# EAGLE schematic RTxController (EAGLE 6.5.0)

## Sheet 1 of 4: Analog
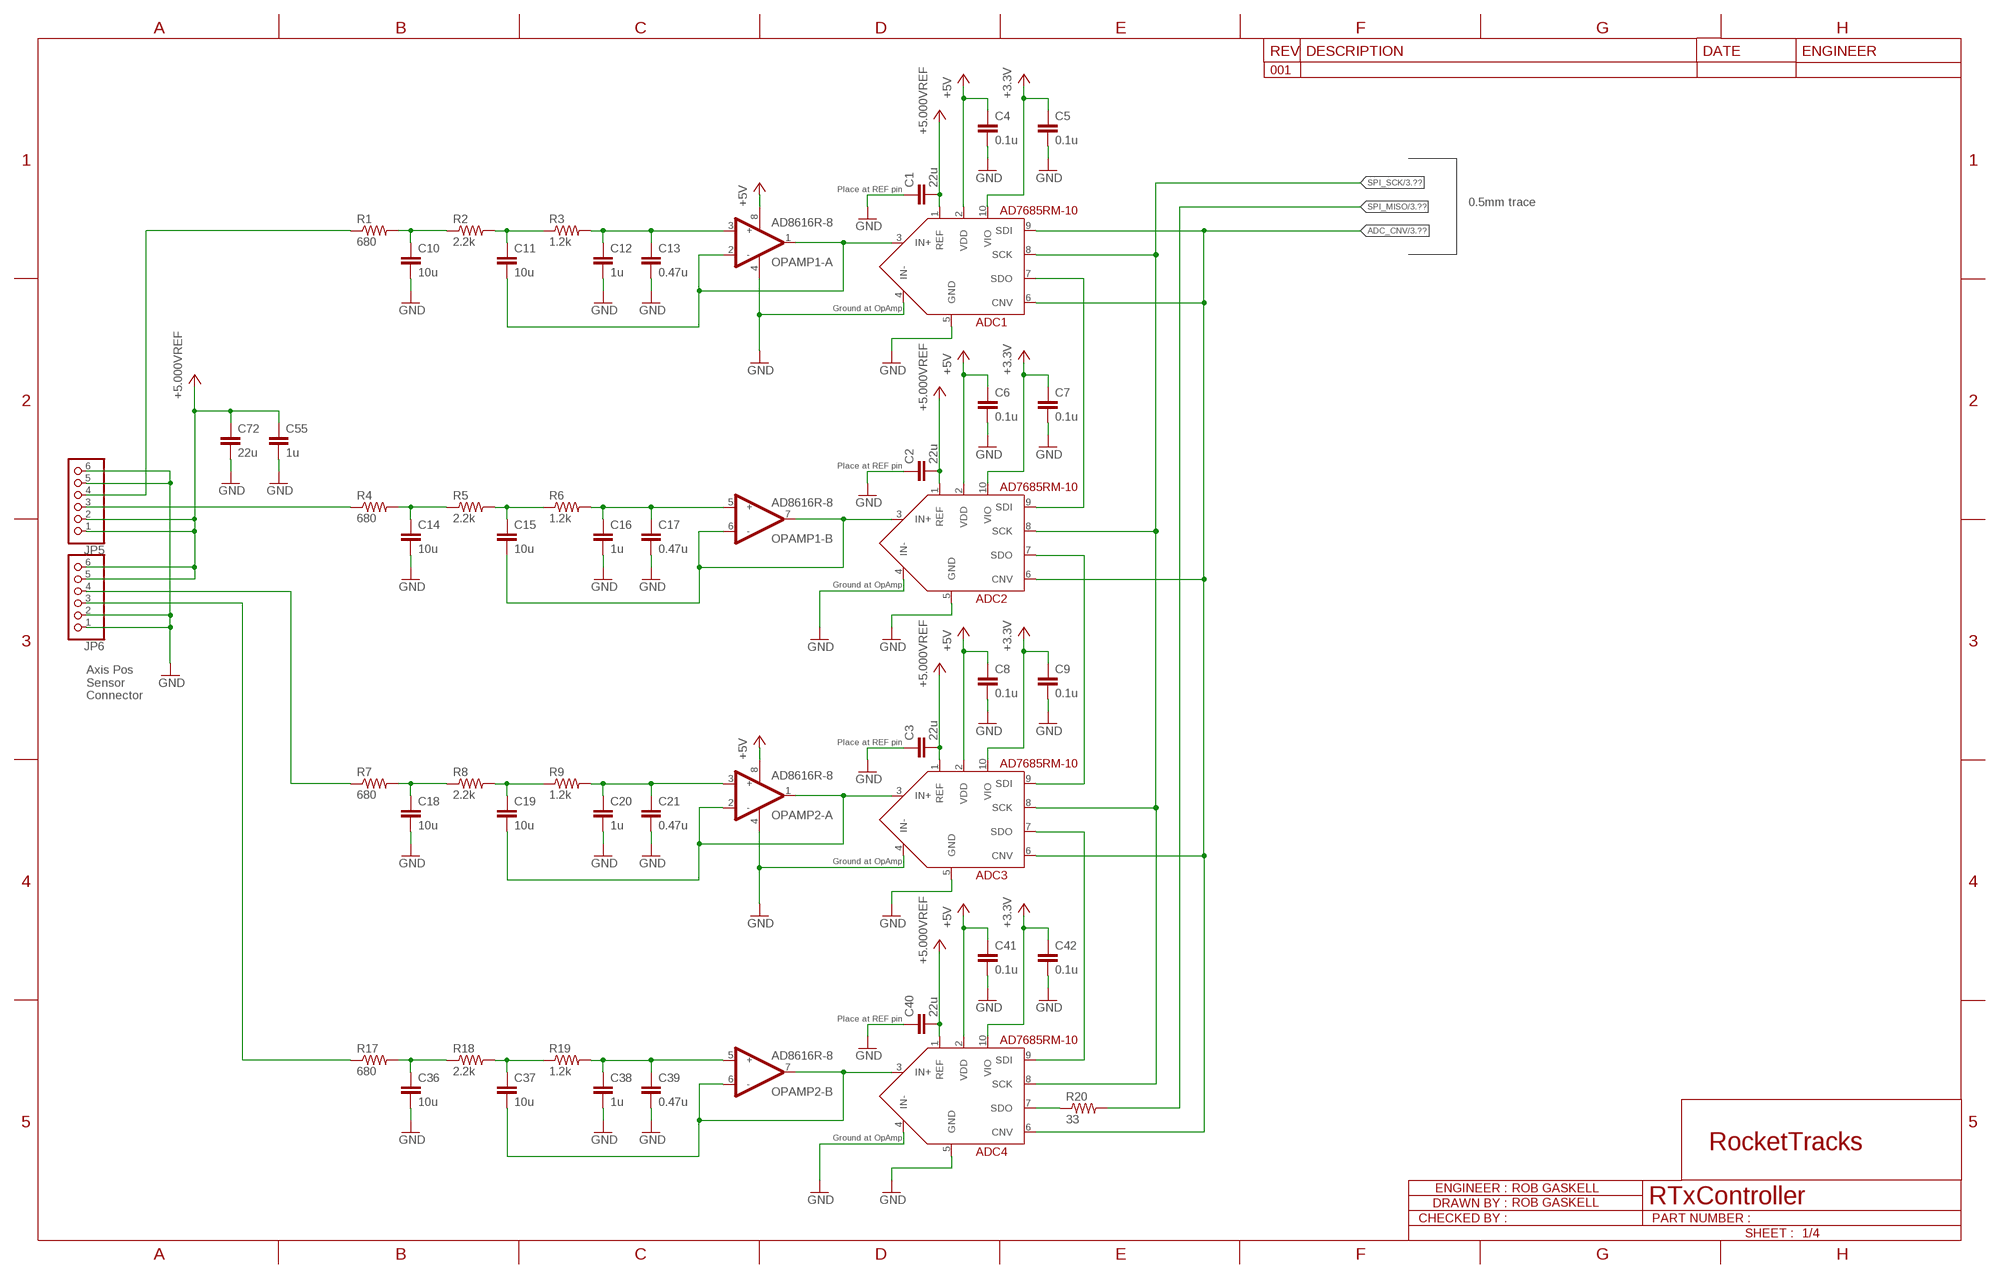
[diagram p0: schematic, sheet 1]

### Parts
ADC1  AD7685RM-10  [MSOP-10]
ADC2  AD7685RM-10  [MSOP-10]
ADC3  AD7685RM-10  [MSOP-10]
ADC4  AD7685RM-10  [MSOP-10]
C1  22u  C-EUC1206  [C1206]
C2  22u  C-EUC1206  [C1206]
C3  22u  C-EUC1206  [C1206]
C4  0.1u  C-EUC0402  [C0402]
C5  0.1u  C-EUC0402  [C0402]
C6  0.1u  C-EUC0402  [C0402]
C7  0.1u  C-EUC0402  [C0402]
C8  0.1u  C-EUC0402  [C0402]
C9  0.1u  C-EUC0402  [C0402]
C10  10u  C-EUC1206  [C1206]
C11  10u  C-EUC1206  [C1206]
C12  1u  C-EUC0805  [C0805]
C13  0.47u  C-EUC0805  [C0805]
C14  10u  C-EUC1206  [C1206]
C15  10u  C-EUC1206  [C1206]
C16  1u  C-EUC0805  [C0805]
C17  0.47u  C-EUC0805  [C0805]
C18  10u  C-EUC1206  [C1206]
C19  10u  C-EUC1206  [C1206]
C20  1u  C-EUC0805  [C0805]
C21  0.47u  C-EUC0805  [C0805]
C36  10u  C-EUC1206  [C1206]
C37  10u  C-EUC1206  [C1206]
C38  1u  C-EUC0805  [C0805]
C39  0.47u  C-EUC0805  [C0805]
C40  22u  C-EUC1206  [C1206]
C41  0.1u  C-EUC0402  [C0402]
C42  0.1u  C-EUC0402  [C0402]
C55  1u  C-EUC0805  [C0805]
C72  22u  C-EUC1206  [C1206]
JP5  PINHD-1X6  [1X06]
JP6  PINHD-1X6  [1X06]
OPAMP1  AD8616R-8  [SOIC8]
OPAMP2  AD8616R-8  [SOIC8]
R1  680  R-US_R0402  [R0402]
R2  2.2k  R-US_R0402  [R0402]
R3  1.2k  R-US_R0402  [R0402]
R4  680  R-US_R0402  [R0402]
R5  2.2k  R-US_R0402  [R0402]
R6  1.2k  R-US_R0402  [R0402]
R7  680  R-US_R0402  [R0402]
R8  2.2k  R-US_R0402  [R0402]
R9  1.2k  R-US_R0402  [R0402]
R17  680  R-US_R0402  [R0402]
R18  2.2k  R-US_R0402  [R0402]
R19  1.2k  R-US_R0402  [R0402]
R20  33  R-US_R0402  [R0402]

### Nets
+3.3V [PWR]: ADC1.10(VIO) ADC2.10(VIO) ADC3.10(VIO) ADC4.10(VIO) C5.1 C7.1 C9.1 C42.1 ; also sheet 2,3,4
+5.000VREF [PWR]: ADC1.1(REF) ADC2.1(REF) ADC3.1(REF) ADC4.1(REF) C1.2 C2.2 C3.2 C40.2 C55.1 C72.1 JP5.1 JP5.2 JP6.5 JP6.6 ; also sheet 2
+5V: ADC1.2(VDD) ADC2.2(VDD) ADC3.2(VDD) ADC4.2(VDD) C4.1 C6.1 C8.1 C41.1 OPAMP1.8(-A:V+) OPAMP2.8(-A:V+) ; also sheet 2
ADC1_IN+: ADC1.3(IN+) C11.2 OPAMP1.1(-A:OUT_A) OPAMP1.2(-A:-)
ADC2_IN+: ADC2.3(IN+) C15.2 OPAMP1.6(-B:-) OPAMP1.7(-B:OUT_B)
ADC3_IN+: ADC3.3(IN+) C19.2 OPAMP2.1(-A:OUT_A) OPAMP2.2(-A:-)
ADC4_IN: ADC4.3(IN+) C37.2 OPAMP2.6(-B:-) OPAMP2.7(-B:OUT_B)
ADC_CNV: ADC1.6(CNV) ADC1.9(SDI) ADC2.6(CNV) ADC3.6(CNV) ADC4.6(CNV) ; also sheet 3
AXIS3_IN: JP6.4 R7.1
AXIS4_IN: JP6.3 R17.1
GND: ADC1.4(IN-) ADC1.5(GND) ADC2.4(IN-) ADC2.5(GND) ADC3.4(IN-) ADC3.5(GND) ADC4.4(IN-) ADC4.5(GND) C1.1 C2.1 C3.1 C4.2 C5.2 C6.2 C7.2 C8.2 C9.2 C10.2 C12.2 C13.2 C14.2 C16.2 C17.2 C18.2 C20.2 C21.2 C36.2 C38.2 C39.2 C40.1 C41.2 C42.2 C55.2 C72.2 JP5.5 JP5.6 JP6.1 JP6.2 OPAMP1.4(-A:V-) OPAMP2.4(-A:V-) ; also sheet 2,3,4
LAT_AXIS_IN: JP5.4 R1.1
N$1: C12.1 C13.1 OPAMP1.3(-A:+) R3.2
N$2: C16.1 C17.1 OPAMP1.5(-B:+) R6.2
N$3: C38.1 C39.1 OPAMP2.5(-B:+) R19.2
N$4: C11.1 R2.2 R3.1
N$5: C37.1 R18.2 R19.1
N$8: C15.1 R5.2 R6.1
N$10: C36.1 R17.2 R18.1
N$11: C14.1 R4.2 R5.1
N$12: C20.1 C21.1 OPAMP2.3(-A:+) R9.2
N$13: C19.1 R8.2 R9.1
N$16: C18.1 R7.2 R8.1
N$22: C10.1 R1.2 R2.1
SDO1: ADC1.7(SDO) ADC2.9(SDI)
SDO2: ADC2.7(SDO) ADC3.9(SDI)
SDO3: ADC3.7(SDO) ADC4.9(SDI)
SDO4: ADC4.7(SDO) R20.1
SPI_MISO: R20.2 ; also sheet 3
SPI_SCK: ADC1.8(SCK) ADC2.8(SCK) ADC3.8(SCK) ADC4.8(SCK) ; also sheet 3
VERT_AXIS_IN: JP5.3 R4.1

### Notes on the sheet
- Place at REF pin
- 0.5mm trace
- Ground at OpAmp
- Place at REF pin
- Ground at OpAmp
- Axis Pos
  Sensor
  Connector
- Place at REF pin
- Ground at OpAmp
- Place at REF pin
- Ground at OpAmp

## Sheet 2 of 4: Power
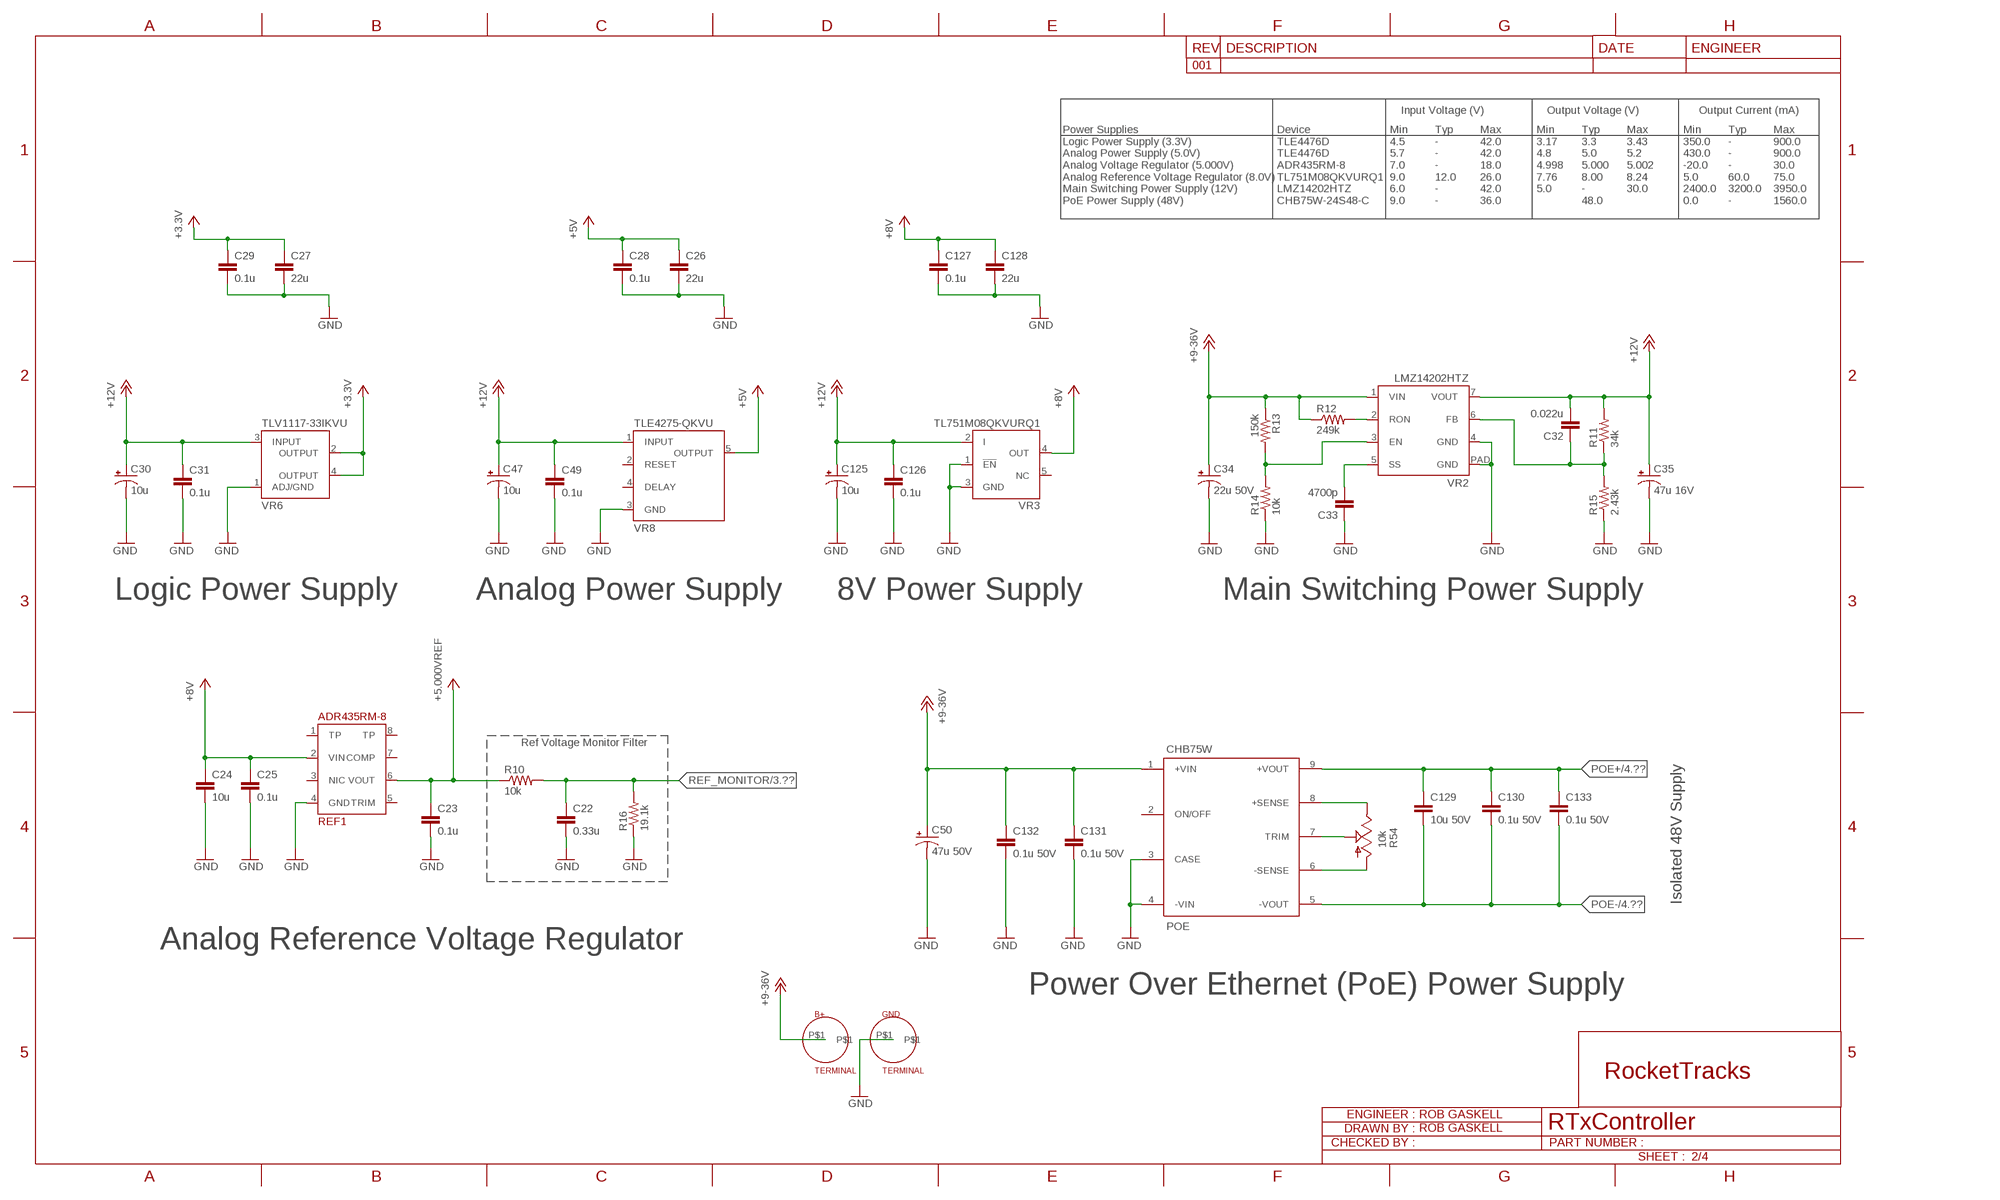
[diagram p1: schematic, sheet 2]

### Parts
B+  TERMINAL  [TERMINAL_RELAY]
C22  0.33u  C-EUC0603  [C0603]
C23  0.1u  C-EUC0402  [C0402]
C24  10u  C-EUC1206  [C1206]
C25  0.1u  C-EUC0402  [C0402]
C26  22u  C-EUC1206  [C1206]
C27  22u  C-EUC1206  [C1206]
C28  0.1u  C-EUC0402  [C0402]
C29  0.1u  C-EUC0402  [C0402]
C30  10u  CPOL-USB  [PANASONIC_B]
C31  0.1u  C-EUC0402  [C0402]
C32  0.022u  C-EUC0402  [C0402]
C33  4700p  C-EUC0402  [C0402]
C34  22u 50V  CPOL-USB  [PANASONIC_B]
C35  47u 16V  CPOL-USB  [PANASONIC_B]
C47  10u  CPOL-USB  [PANASONIC_B]
C49  0.1u  C-EUC0402  [C0402]
C50  47u 50V  CPOL-USC  [PANASONIC_C]
C125  10u  CPOL-USB  [PANASONIC_B]
C126  0.1u  C-EUC0402  [C0402]
C127  0.1u  C-EUC0402  [C0402]
C128  22u  C-EUC1206  [C1206]
C129  10u 50V  C-EUC1206  [C1206]
C130  0.1u 50V  C-EUC0402  [C0402]
C131  0.1u 50V  C-EUC0402  [C0402]
C132  0.1u 50V  C-EUC0402  [C0402]
C133  0.1u 50V  C-EUC0402  [C0402]
GND  TERMINAL  [TERMINAL_RELAY]
POE  CHB75W  [CHB75W]
R10  10k  R-US_R0402  [R0402]
R11  34k  R-US_R0603  [R0603]
R12  249k  R-US_R0603  [R0603]
R13  150k  R-US_R0603  [R0603]
R14  10k  R-US_R0603  [R0603]
R15  2.43k  R-US_R0603  [R0603]
R16  19.1k  R-US_R0402  [R0402]
R54  10k  TRIM_US-3223W  [3223W]
REF1  ADR435RM-8  [SOIC8]
VR2  LMZ14202HTZ  [PFM-7]
VR3  TL751M08QKVURQ1  [PG-TO252-5-11]
VR6  TLV1117-33IKVU  [PG-TO252-3-11]
VR8  TLE4275-QKVU  [PG-TO252-5-11]

### Nets
+3.3V [PWR]: C27.1 C29.1 VR6.2(OUTPUT) VR6.4(OUTPUT) ; also sheet 1,3,4
+5.000VREF [PWR]: C23.1 R10.1 REF1.6(VOUT) ; also sheet 1
+5V: C26.1 C28.1 VR8.5(OUTPUT) ; also sheet 1
+8V [PWR]: C24.1 C25.1 C127.1 C128.1 REF1.2(VIN) VR3.4(OUT)
+9-36V: B+.P$1 C34.+ C50.+ C131.1 C132.1 POE.1(+VIN) R12.1 R13.1 VR2.1(VIN)
+12V: C30.+ C31.1 C32.2 C35.+ C47.+ C49.1 C125.+ C126.1 R11.2 VR2.7(VOUT) VR3.2(I) VR6.3(INPUT) VR8.1(INPUT)
GND: C22.2 C23.2 C24.2 C25.2 C26.2 C27.2 C28.2 C29.2 C30.- C31.2 C33.1 C34.- C35.- C47.- C49.2 C50.- C125.- C126.2 C127.2 C128.2 C131.2 C132.2 GND.P$1 POE.3(CASE) POE.4(-VIN) R14.1 R15.1 R16.1 REF1.4(GND) VR2.4(GND) VR2.PAD(GND) VR3.1(!EN!) VR3.3(GND) VR6.1(ADJ/GND) VR8.3(GND) ; also sheet 1,3,4
N$17: R12.2 VR2.2(RON)
N$18: R13.2 R14.2 VR2.3(EN)
N$19: C33.2 VR2.5(SS)
N$20: C32.1 R11.1 R15.2 VR2.6(FB)
N$65: POE.7(TRIM) R54.2(S)
N$66: POE.6(-SENSE) R54.1(A)
N$67: POE.8(+SENSE) R54.3(E)
POE+: C129.1 C130.1 C133.1 POE.9(+VOUT) ; also sheet 4
POE-: C129.2 C130.2 C133.2 POE.5(-VOUT) ; also sheet 4
REF_MONITOR: C22.1 R10.2 R16.2 ; also sheet 3
Unconnected: POE.2(ON/OFF) REF1.1(TP) REF1.3(NIC) REF1.5(TRIM) REF1.7(COMP) REF1.8(TP) VR3.5(NC) VR8.2(RESET) VR8.4(DELAY)

### Notes on the sheet
- Input Voltage (V)                     Output Voltage (V)                    Output Current (mA)
- Power Supplies
  Logic Power Supply (3.3V)
  Analog Power Supply (5.0V)
  Analog Voltage Regulator (5.000V)
  Analog Reference Voltage Regulator (8.0V)
  Main Switching Power Supply (12V)
  PoE Power Supply (48V)
- Device
  TLE4476D
  TLE4476D
  ADR435RM-8
  TL751M08QKVURQ1
  LMZ14202HTZ
  CHB75W-24S48-C
- Min
  4.5
  5.7
  7.0
  9.0
  6.0
  9.0
- Typ
  -
  -
  -
  12.0
  -
  -
- Max
  42.0
  42.0
  18.0
  26.0
  42.0
  36.0
- Min
  3.17
  4.8
  4.998
  7.76
  5.0
- Typ
  3.3
  5.0
  5.000
  8.00
  -
  48.0
- Max
  3.43
  5.2
  5.002
  8.24
  30.0
- Min
  350.0
  430.0
  -20.0
  5.0
  2400.0
  0.0
- Typ
  -
  -
  -
  60.0
  3200.0
  -
- Max
  900.0
  900.0
  30.0
  75.0
  3950.0
  1560.0
- Logic Power Supply | Analog Power Supply | 8V Power Supply | Main Switching Power Supply
- Ref Voltage Monitor Filter
- Isolated 48V Supply
- Analog Reference Voltage Regulator
- Power Over Ethernet (PoE) Power Supply

## Sheet 3 of 4: MCU
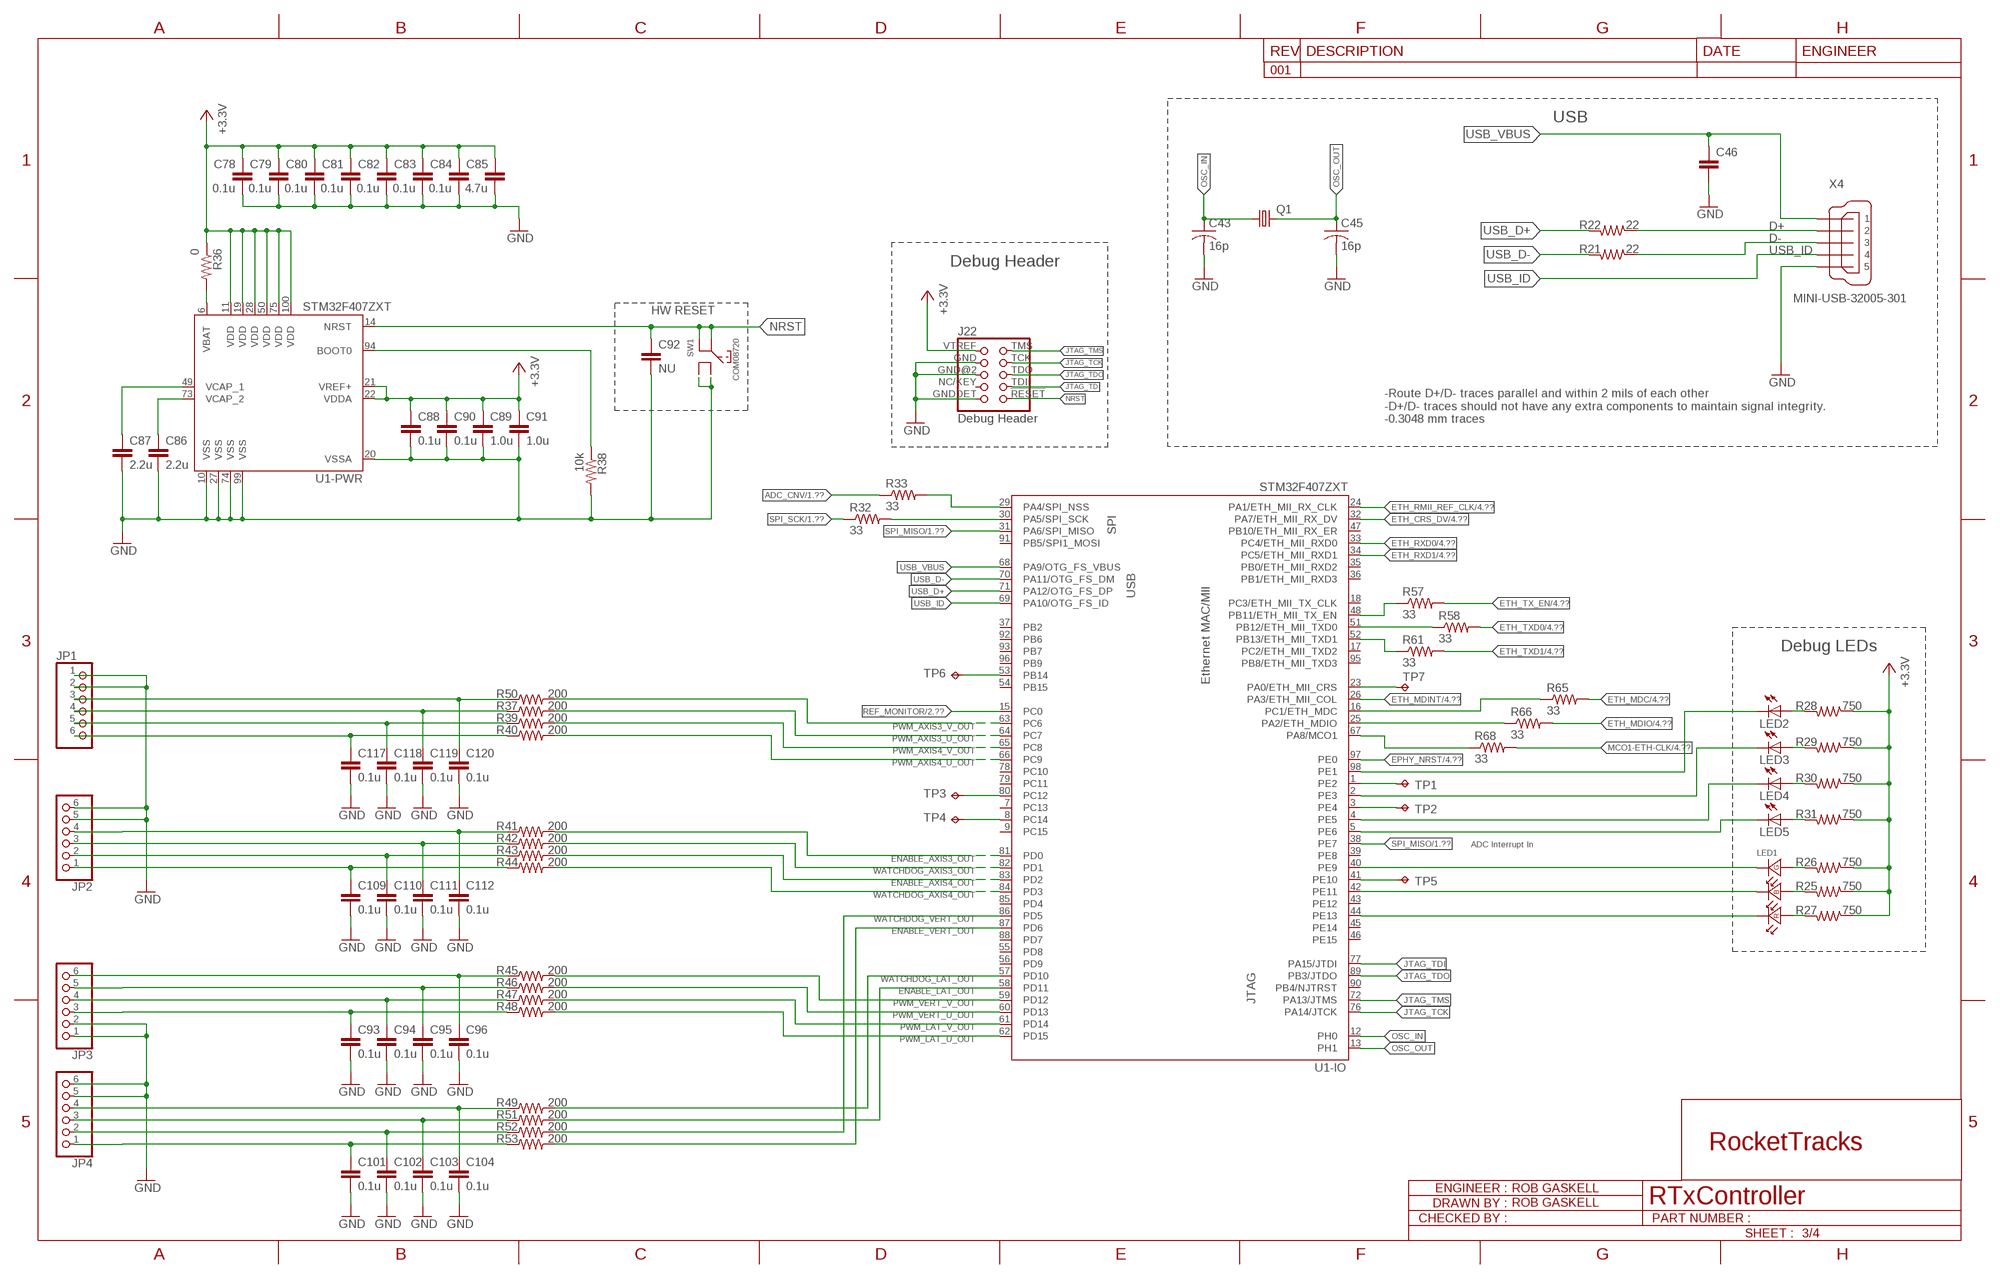
[diagram p2: schematic, sheet 3]

### Parts
C43  16p  C-USC0402  [C0402]
C45  16p  C-USC0402  [C0402]
C46  C-EUC0603  [C0603]
C78  0.1u  C-EUC0402  [C0402]
C79  0.1u  C-EUC0402  [C0402]
C80  0.1u  C-EUC0402  [C0402]
C81  0.1u  C-EUC0402  [C0402]
C82  0.1u  C-EUC0402  [C0402]
C83  0.1u  C-EUC0402  [C0402]
C84  0.1u  C-EUC0402  [C0402]
C85  4.7u  C-EUC0603  [C0603]
C86  2.2u  C-EUC0402  [C0402]
C87  2.2u  C-EUC0402  [C0402]
C88  0.1u  C-EUC0402  [C0402]
C89  1.0u  C-EUC0402  [C0402]
C90  0.1u  C-EUC0402  [C0402]
C91  1.0u  C-EUC0402  [C0402]
C92  NU  C-EUC0402  [C0402]
C93  0.1u  C-EUC0603  [C0603]
C94  0.1u  C-EUC0603  [C0603]
C95  0.1u  C-EUC0603  [C0603]
C96  0.1u  C-EUC0603  [C0603]
C101  0.1u  C-EUC0603  [C0603]
C102  0.1u  C-EUC0603  [C0603]
C103  0.1u  C-EUC0603  [C0603]
C104  0.1u  C-EUC0603  [C0603]
C109  0.1u  C-EUC0603  [C0603]
C110  0.1u  C-EUC0603  [C0603]
C111  0.1u  C-EUC0603  [C0603]
C112  0.1u  C-EUC0603  [C0603]
C117  0.1u  C-EUC0603  [C0603]
C118  0.1u  C-EUC0603  [C0603]
C119  0.1u  C-EUC0603  [C0603]
C120  0.1u  C-EUC0603  [C0603]
J22  Debug Header  1.27MM_HDR_2X5  [1.27MM_2X5]
JP1  PINHD-1X6  [1X06]
JP2  PINHD-1X6  [1X06]
JP3  PINHD-1X6  [1X06]
JP4  PINHD-1X6  [1X06]
LED1  LED_RGB_PLCC-6  [PLCC-6]
LED2  LEDCHIP-LED0603  [CHIP-LED0603]
LED3  LEDCHIP-LED0603  [CHIP-LED0603]
LED4  LEDCHIP-LED0603  [CHIP-LED0603]
LED5  LEDCHIP-LED0603  [CHIP-LED0603]
Q1  CRYSTALCTS406  [CTS406]
R21  22  R-US_R0402  [R0402]
R22  22  R-US_R0402  [R0402]
R25  750  R-US_R0402  [R0402]
R26  750  R-US_R0402  [R0402]
R27  750  R-US_R0402  [R0402]
R28  750  R-US_R0402  [R0402]
R29  750  R-US_R0402  [R0402]
R30  750  R-US_R0402  [R0402]
R31  750  R-US_R0402  [R0402]
R32  33  R-US_R0402  [R0402]
R33  33  R-US_R0402  [R0402]
R36  0  R-US_R0603  [R0603]
R37  200  R-US_R0603  [R0603]
R38  10k  R-US_R0603  [R0603]
R39  200  R-US_R0603  [R0603]
R40  200  R-US_R0603  [R0603]
R41  200  R-US_R0603  [R0603]
R42  200  R-US_R0603  [R0603]
R43  200  R-US_R0603  [R0603]
R44  200  R-US_R0603  [R0603]
R45  200  R-US_R0603  [R0603]
R46  200  R-US_R0603  [R0603]
R47  200  R-US_R0603  [R0603]
R48  200  R-US_R0603  [R0603]
R49  200  R-US_R0603  [R0603]
R50  200  R-US_R0603  [R0603]
R51  200  R-US_R0603  [R0603]
R52  200  R-US_R0603  [R0603]
R53  200  R-US_R0603  [R0603]
R57  33  R-US_R0402  [R0402]
R58  33  R-US_R0402  [R0402]
R61  33  R-US_R0402  [R0402]
R65  33  R-US_R0402  [R0402]
R66  33  R-US_R0402  [R0402]
R68  33  R-US_R0402  [R0402]
SW1  COM08720  [COM08720]
TP1  TPTP06R  [TP06R]
TP2  TPTP06R  [TP06R]
TP3  TPTP06R  [TP06R]
TP4  TPTP06R  [TP06R]
TP5  TPTP06R  [TP06R]
TP6  TPTP06R  [TP06R]
TP7  TPTP06R  [TP06R]
U1  STM32F407ZXT  [LQFP-100]
X4  MINI-USB-32005-301  [32005-301]

### Nets
+3.3V [PWR]: C78.1 C79.1 C80.1 C81.1 C82.1 C83.1 C84.1 C85.1 C88.1 C89.1 C90.1 C91.1 J22.VTREF R25.1 R26.1 R27.1 R28.1 R29.1 R30.1 R31.1 R36.1 U1.11(-PWR:VDD) U1.19(-PWR:VDD) U1.21(-PWR:VREF+) U1.22(-PWR:VDDA) U1.28(-PWR:VDD) U1.50(-PWR:VDD) U1.75(-PWR:VDD) U1.100(-PWR:VDD) ; also sheet 1,2,4
ADC_CNV: R33.1 ; also sheet 1
BOOT0: R38.1 U1.94(-PWR:BOOT0)
D+: R22.1 X4.2
D-: R21.1 X4.3
ENABLE_AXIS3_OUT: R41.2 U1.81(-IO:PD0)
ENABLE_AXIS4_OUT: R43.2 U1.83(-IO:PD2)
ENABLE_LAT_OUT: R51.2 U1.58(-IO:PD11)
ENABLE_VERT_OUT: R53.2 U1.87(-IO:PD6)
EPHY_NRST: U1.97(-IO:PE0) ; also sheet 4
ETH_CRS_DV: U1.32(-IO:PA7/ETH_MII_RX_DV) ; also sheet 4
ETH_MDC: R65.2 ; also sheet 4
ETH_MDINT: U1.26(-IO:PA3/ETH_MII_COL) ; also sheet 4
ETH_MDIO: R66.2 ; also sheet 4
ETH_RMII_REF_CLK: U1.24(-IO:PA1/ETH_MII_RX_CLK) ; also sheet 4
ETH_RXD0: U1.33(-IO:PC4/ETH_MII_RXD0) ; also sheet 4
ETH_RXD1: U1.34(-IO:PC5/ETH_MII_RXD1) ; also sheet 4
ETH_TX_EN: R57.2 ; also sheet 4
ETH_TXD0: R58.2 ; also sheet 4
ETH_TXD1: R61.2 ; also sheet 4
GND: C43.2 C45.2 C46.2 C78.2 C79.2 C80.2 C81.2 C82.2 C83.2 C84.2 C85.2 C86.2 C87.2 C88.2 C89.2 C90.2 C91.2 C92.2 C93.2 C94.2 C95.2 C96.2 C101.2 C102.2 C103.2 C104.2 C109.2 C110.2 C111.2 C112.2 C117.2 C118.2 C119.2 C120.2 J22.GND J22.GND@2(GND) J22.GNDDET JP1.1 JP1.2 JP2.5 JP2.6 JP3.1 JP3.2 JP4.5 JP4.6 R38.2 SW1.2 SW1.4 U1.10(-PWR:VSS) U1.20(-PWR:VSSA) U1.27(-PWR:VSS) U1.74(-PWR:VSS) U1.99(-PWR:VSS) X4.5 ; also sheet 1,2,4
JTAG_TCK: J22.TCK U1.76(-IO:PA14/JTCK)
JTAG_TDI: J22.TDI U1.77(-IO:PA15/JTDI)
JTAG_TDO: J22.TDO U1.89(-IO:PB3/JTDO)
JTAG_TMS: J22.TMS U1.72(-IO:PA13/JTMS)
MCO1-ETH-CLK: R68.2 ; also sheet 4
N$23: LED2.A R28.2
N$24: LED3.A R29.2
N$25: LED1.3(G:A) R26.2
N$31: LED1.4(B:A) R25.2
N$32: LED1.1(R:A) R27.2
N$42: C96.1 JP3.6 R45.1
N$43: R36.2 U1.6(-PWR:VBAT)
N$45: C95.1 JP3.5 R46.1
N$46: C94.1 JP3.4 R47.1
N$47: C93.1 JP3.3 R48.1
N$48: C104.1 JP4.4 R49.1
N$49: C103.1 JP4.3 R51.1
N$50: C102.1 JP4.2 R52.1
N$51: C101.1 JP4.1 R53.1
N$52: C112.1 JP2.4 R41.1
N$53: C111.1 JP2.3 R42.1
N$54: C110.1 JP2.2 R43.1
N$55: C109.1 JP2.1 R44.1
N$56: LED4.A R30.2
N$57: LED5.A R31.2
N$58: LED1.5(B:K) U1.42(-IO:PE11)
N$59: LED1.2(G:K) U1.40(-IO:PE9)
N$60: LED1.6(R:K) U1.44(-IO:PE13)
N$61: C120.1 JP1.3 R50.1
N$62: C119.1 JP1.4 R37.1
N$63: C118.1 JP1.5 R39.1
N$64: C117.1 JP1.6 R40.1
N$68: LED5.C U1.5(-IO:PE6)
N$69: LED4.C U1.4(-IO:PE5)
N$70: LED3.C U1.2(-IO:PE3)
N$71: LED2.C U1.98(-IO:PE1)
N$73: R33.2 U1.29(-IO:PA4/SPI_NSS)
N$75: R57.1 U1.48(-IO:PB11/ETH_MII_TX_EN)
N$76: R61.1 U1.52(-IO:PB13/ETH_MII_TXD1)
N$77: R58.1 U1.51(-IO:PB12/ETH_MII_TXD0)
N$81: R65.1 U1.16(-IO:PC1/ETH_MDC)
N$85: R66.1 U1.25(-IO:PA2/ETH_MDIO)
N$86: R68.1 U1.67(-IO:PA8/MCO1)
NRST: C92.1 J22.!RESET SW1.1 SW1.3 U1.14(-PWR:NRST)
OSC_IN: C43.1 Q1.1 U1.12(-IO:PH0)
OSC_OUT: C45.1 Q1.3 U1.13(-IO:PH1)
PWM_AXIS3_U_OUT: R37.2 U1.64(-IO:PC7)
PWM_AXIS3_V_OUT: R50.2 U1.63(-IO:PC6)
PWM_AXIS4_U_OUT: R40.2 U1.66(-IO:PC9)
PWM_AXIS4_V_OUT: R39.2 U1.65(-IO:PC8)
PWM_LAT_U_OUT: R48.2 U1.62(-IO:PD15)
PWM_LAT_V_OUT: R47.2 U1.61(-IO:PD14)
PWM_VERT_U_OUT: R46.2 U1.60(-IO:PD13)
PWM_VERT_V_OUT: R45.2 U1.59(-IO:PD12)
REF_MONITOR: U1.15(-IO:PC0) ; also sheet 2
SPI_MISO: U1.31(-IO:PA6/SPI_MISO) U1.38(-IO:PE7) ; also sheet 1
SPI_SCK: R32.1 ; also sheet 1
SPI_SCK_MCU: R32.2 U1.30(-IO:PA5/SPI_SCK)
TP1: TP1.TP U1.1(-IO:PE2)
TP2: TP2.TP U1.3(-IO:PE4)
TP3: TP3.TP U1.80(-IO:PC12)
TP4: TP4.TP U1.8(-IO:PC14)
TP5: TP5.TP U1.41(-IO:PE10)
TP6: TP6.TP U1.53(-IO:PB14)
TP7: TP7.TP U1.23(-IO:PA0/ETH_MII_CRS)
USB_D+: R22.2 U1.71(-IO:PA12/OTG_FS_DP)
USB_D-: R21.2 U1.70(-IO:PA11/OTG_FS_DM)
USB_ID: U1.69(-IO:PA10/OTG_FS_ID) X4.4
USB_VBUS: C46.1 U1.68(-IO:PA9/OTG_FS_VBUS) X4.1
VCAP_1: C87.1 U1.49(-PWR:VCAP_1)
VCAP_2: C86.1 U1.73(-PWR:VCAP_2)
WATCHDOG_AXIS3_OUT: R42.2 U1.82(-IO:PD1)
WATCHDOG_AXIS4_OUT: R44.2 U1.84(-IO:PD3)
WATCHDOG_LAT_OUT: R49.2 U1.57(-IO:PD10)
WATCHDOG_VERT_OUT: R52.2 U1.86(-IO:PD5)
Unconnected: J22.NC/KEY U1.7(-IO:PC13) U1.9(-IO:PC15) U1.17(-IO:PC2/ETH_MII_TXD2) U1.18(-IO:PC3/ETH_MII_TX_CLK) U1.35(-IO:PB0/ETH_MII_RXD2) U1.36(-IO:PB1/ETH_MII_RXD3) U1.37(-IO:PB2) U1.39(-IO:PE8) U1.43(-IO:PE12) U1.45(-IO:PE14) U1.46(-IO:PE15) U1.47(-IO:PB10/ETH_MII_RX_ER) U1.54(-IO:PB15) U1.55(-IO:PD8) U1.56(-IO:PD9) U1.78(-IO:PC10) U1.79(-IO:PC11) U1.85(-IO:PD4) U1.88(-IO:PD7) U1.90(-IO:PB4/NJTRST) U1.91(-IO:PB5/SPI1_MOSI) U1.92(-IO:PB6) U1.93(-IO:PB7) U1.95(-IO:PB8/ETH_MII_TXD3) U1.96(-IO:PB9)

### Notes on the sheet
- USB
- Debug Header
- HW RESET
- -Route D+/D- traces parallel and within 2 mils of each other
  -D+/D- traces should not have any extra components to maintain signal integrity.
  -0.3048 mm traces
- Debug LEDs
- ADC Interrupt In

## Sheet 4 of 4: ETH
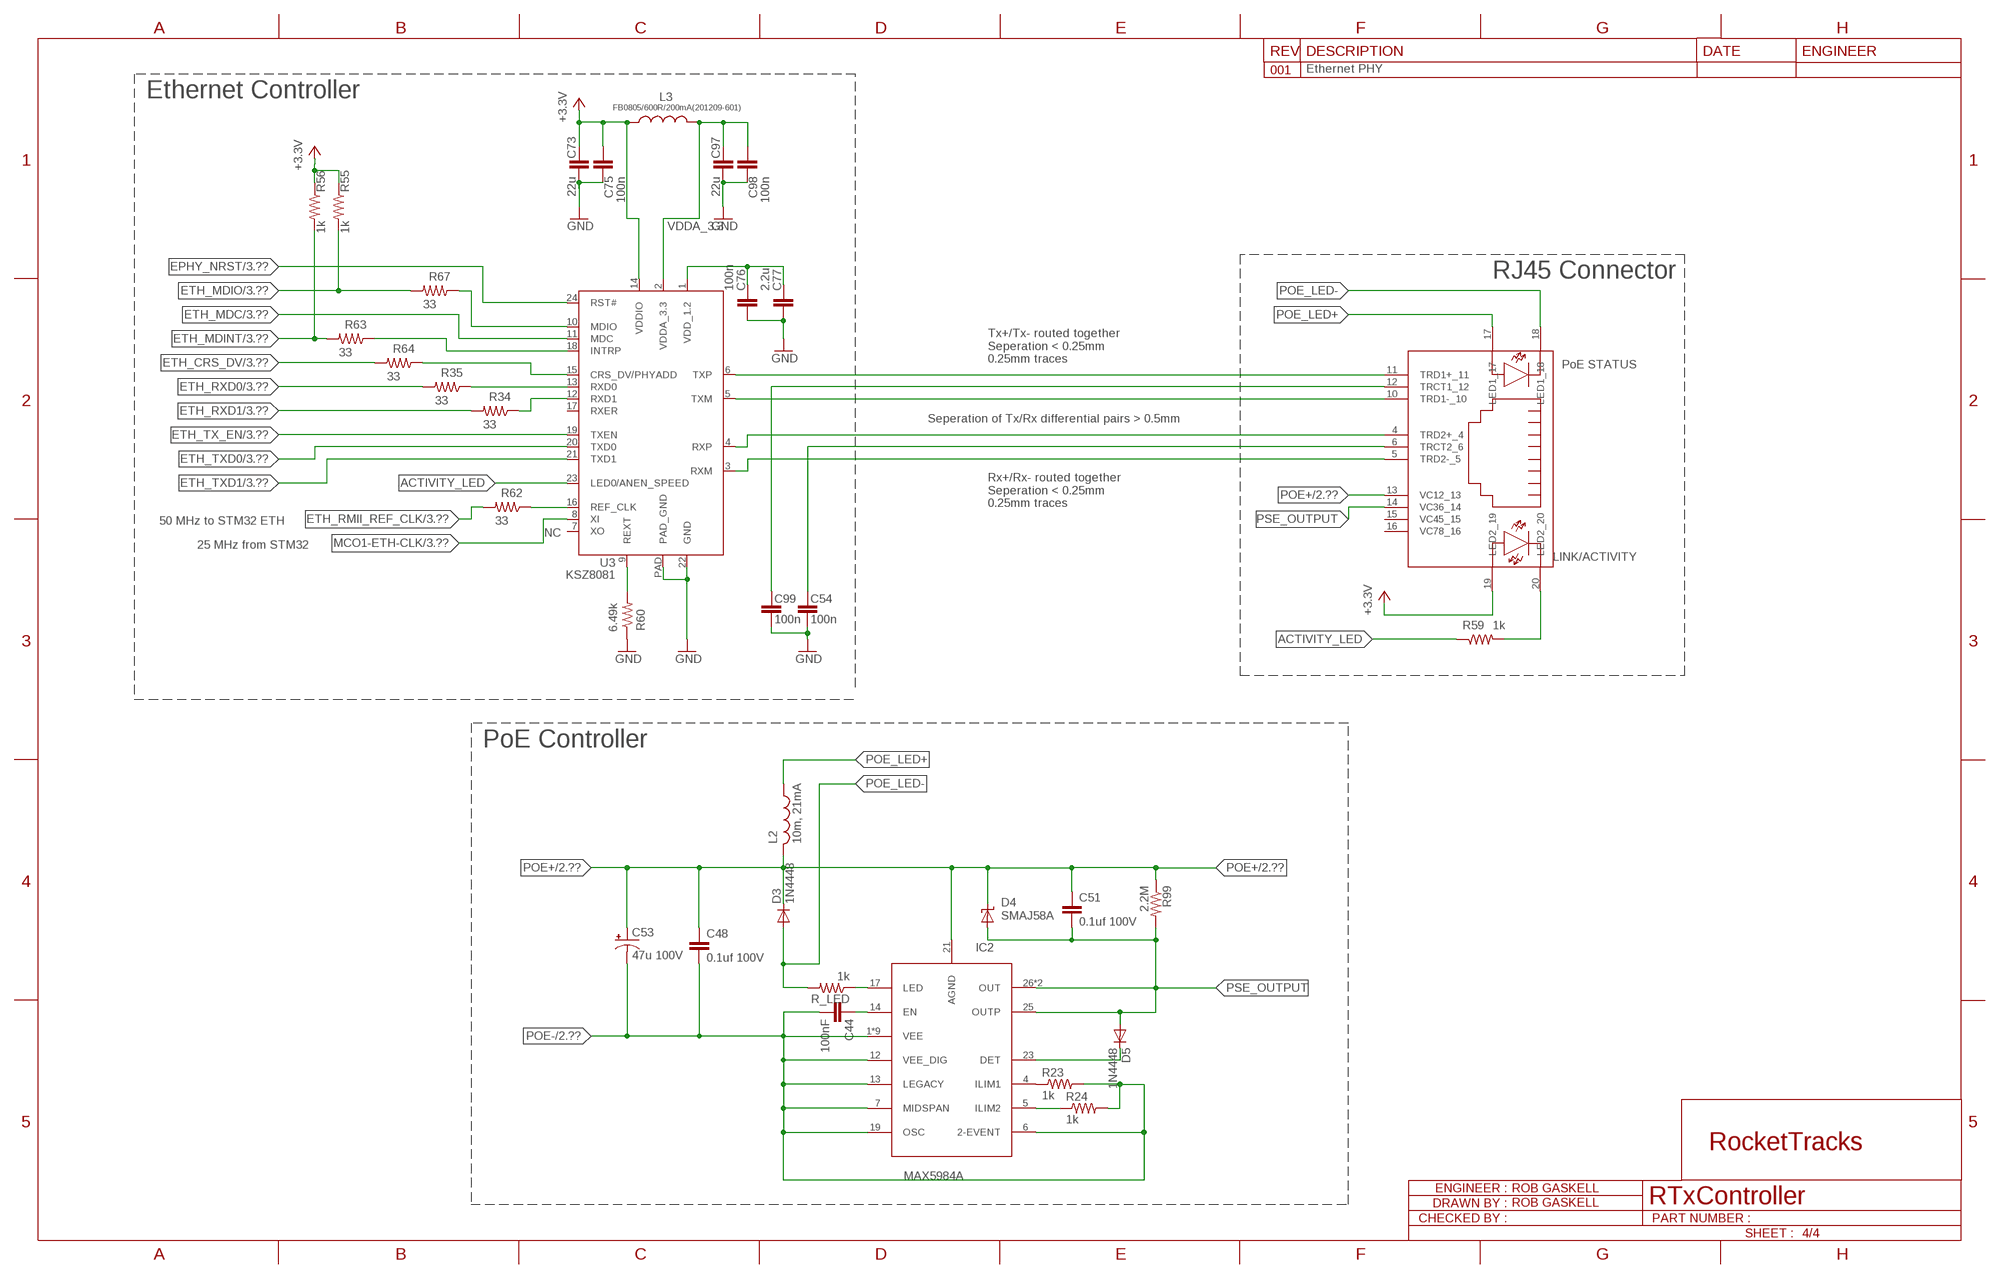
[diagram p3: schematic, sheet 4]

### Parts
C44  100nF  C-EUC0805K  [C0805K]
C48  0.1uf 100V  C-EUC0805K  [C0805K]
C51  0.1uf 100V  C-EUC0805K  [C0805K]
C53  47u 100V  CPOL-USC  [PANASONIC_C]
C54  100n  C-EU0402-C-NOSILK  [0402-C-NOSILK]
C73  22u  C-EU1206-C  [1206-C]
C75  100n  C-EU0402-C-NOSILK  [0402-C-NOSILK]
C76  100n  C-EU0402-C-NOSILK  [0402-C-NOSILK]
C77  2.2u  C-EU0402-C-NOSILK  [0402-C-NOSILK]
C97  22u  C-EU1206-C  [1206-C]
C98  100n  C-EU0402-C-NOSILK  [0402-C-NOSILK]
C99  100n  C-EU0402-C-NOSILK  [0402-C-NOSILK]
D3  1N4448  [SOD-123]
D4  SMAJ58A  SUPPRESSOR-SMBJ  [SMBJ]
D5  1N4448  [SOD-123]
IC2  MAX5984A  MAX5984  [TQFN-28]
L2  10m, 21mA  L-US0204V  [0204V]
L3  FB0805/600R/200mA(201209-601)  L-US0805-C-NOSILK  [0805-C-NOSILK]
R23  1k  R-US_R0603  [R0603]
R24  1k  R-US_R0603  [R0603]
R34  33  R-US_0402-C-NOSILK  [0402-C-NOSILK]
R35  33  R-US_0402-C-NOSILK  [0402-C-NOSILK]
R55  1k  R-US_0402-C-NOSILK  [0402-C-NOSILK]
R56  1k  R-US_0402-C-NOSILK  [0402-C-NOSILK]
R59  1k  R-US_0402-C-NOSILK  [0402-C-NOSILK]
R60  6.49k  R-US_0402-C-NOSILK  [0402-C-NOSILK]
R62  33  R-US_0402-C-NOSILK  [0402-C-NOSILK]
R63  33  R-US_0402-C-NOSILK  [0402-C-NOSILK]
R64  33  R-US_0402-C-NOSILK  [0402-C-NOSILK]
R67  33  R-US_0402-C-NOSILK  [0402-C-NOSILK]
R99  2.2M  R-US_R0603  [R0603]
R_LED  1k  R-US_R0603  [R0603]
U3  KSZ8081  [QFN-24]
X8  0826-1X1T-GJ-F  [MAGJACK-RJ45]

### Nets
+3.3V [PWR]: C73.2 C75.2 L3.2 R55.1 R56.1 U3.14(VDDIO) X8.19(LED2_19) ; also sheet 1,2,3
ACTIVITY_LED: R59.1 U3.23(LED0/ANEN_SPEED)
EPHY_NRST: U3.24(RST#) ; also sheet 3
ETH_CRS_DV: R64.2 ; also sheet 3
ETH_MDC: U3.11(MDC) ; also sheet 3
ETH_MDINT: R56.2 R63.2 ; also sheet 3
ETH_MDIO: R55.2 R67.2 ; also sheet 3
ETH_RMII_REF_CLK: R62.2 ; also sheet 3
ETH_RXD0: R35.2 ; also sheet 3
ETH_RXD1: R34.2 ; also sheet 3
ETH_TX_EN: U3.19(TXEN) ; also sheet 3
ETH_TXD0: U3.20(TXD0) ; also sheet 3
ETH_TXD1: U3.21(TXD1) ; also sheet 3
GND: C54.1 C73.1 C75.1 C76.2 C77.2 C97.1 C98.1 C99.1 R60.1 U3.22(GND) U3.PAD(PAD_GND) ; also sheet 1,2,3
MCO1-ETH-CLK: U3.8(XI) ; also sheet 3
N$15: R59.2 X8.20(LED2_20)
N$21: U3.6(TXP) X8.11(TRD1+_11)
N$26: U3.5(TXM) X8.10(TRD1-_10)
N$27: U3.4(RXP) X8.4(TRD2+_4)
N$28: U3.3(RXM) X8.5(TRD2-_5)
N$29: IC2.17(LED) R_LED.1
N$30: C44.1 IC2.14(EN)
N$34: D5.P$2(C) IC2.23(DET)
N$35: IC2.4(ILIM1) R23.1
N$36: IC2.5(ILIM2) R24.1
N$72: R35.1 U3.13(RXD0)
N$74: R34.1 U3.12(RXD1)
N$78: R62.1 U3.16(REF_CLK)
N$79: R60.2 U3.9(REXT)
N$80: C76.1 C77.1 U3.1(VDD_1.2)
N$82: C99.2 X8.12(TRCT1_12)
N$83: R63.1 U3.18(INTRP)
N$84: R64.1 U3.15(CRS_DV/PHYADD)
N$87: R67.1 U3.10(MDIO)
POE+: C48.1 C51.1 C53.+ D3.P$2(C) D4.C IC2.21(AGND) L2.2 R99.1 X8.13(VC12_13) ; also sheet 2
POE-: C44.2 C48.2 C53.- IC2.1(VEE) IC2.2(VEE) IC2.3(VEE) IC2.6(2-EVENT) IC2.7(MIDSPAN) IC2.8(VEE) IC2.9(VEE) IC2.10(VEE) IC2.11(VEE) IC2.12(VEE_DIG) IC2.13(LEGACY) IC2.15(VEE) IC2.19(OSC) IC2.PAD(VEE) R23.2 R24.2 ; also sheet 2
POE_LED+: L2.1 X8.17(LED1_17)
POE_LED-: D3.P$1(A) R_LED.2 X8.18(LED1_18)
PSE_OUTPUT: C51.2 D4.A D5.P$1(A) IC2.25(OUTP) IC2.26(OUT) IC2.27(OUT) R99.2 X8.14(VC36_14)
VDDA: C54.2 X8.6(TRCT2_6)
VDDA_3.3: C97.2 C98.2 L3.1 U3.2(VDDA_3.3)
Unconnected: U3.7(XO) U3.17(RXER) X8.15(VC45_15) X8.16(VC78_16)

### Notes on the sheet
- Ethernet PHY
- Ethernet Controller
- RJ45 Connector
- Tx+/Tx- routed together
  Seperation < 0.25mm
  0.25mm traces
- PoE STATUS
- Seperation of Tx/Rx differential pairs > 0.5mm
- Rx+/Rx- routed together
  Seperation < 0.25mm
  0.25mm traces
- 50 MHz to STM32 ETH
- NC
- 25 MHz from STM32
- LINK/ACTIVITY
- PoE Controller

## Library data of the parts
ADC1-ADC4 = motorFeedback:AD7685
B+ GND = temp_library:TERMINAL
C1-C29 C31-C33 C36-C42 C44 C48 C49 C51 C55 C72 C78-C96 C101-C104 C109-C112 C117-C120 C126-C133 = motorFeedback:C-EU: CAPACITOR, European symbol
C30 C34 C35 C47 C125 = motorFeedback:CPOL-US: POLARIZED CAPACITOR, American symbol
C43 C45 = rcl:C-US: CAPACITOR, American symbol
C46 = rcl:C-EU: CAPACITOR, European symbol
C50 C53 = rcl:CPOL-US: POLARIZED CAPACITOR, American symbol
C54 C73 C75-C77 C97-C99 = rcl_custom:C-EU: CAPACITOR, European symbol
D3 D5 = temp_library:1N4448
D4 = diode:SUPPRESSOR-: Suppressor diode
IC2 = temp_library:MAX5984; VARIANT: C
J22 = headers:1.27MM_HDR_2X5
JP1-JP6 = pinhead:PINHD-1X6: PIN HEADER
L2 = motorFeedback:L-US: INDUCTOR, American symbol
L3 = rcl_custom:L-US: INDUCTOR, American symbol
LED1 = LED_RGB_PLCC6:LED_RGB_*: RGB LED with separate contacts for all 3 chips
LED2-LED5 = led:LED: LED OSRAM: - CHIPLED LG R971, LG N971, LY N971, LG Q971, LY Q971, LO R971, LY R971 LH N974, LH R974 LS Q976, LO Q976, LY Q976 LO Q996 - Hyper CHIPLED LW Q18S LB Q993, LB Q99A, LB R99A - SideLED LS A670, LO A670, LY A670, LG A670, LP A670 LB A673, LV A673, LT A673, LW A673 LH A674 LY A675 LS A676, LA A676, LO A676, LY A676, LW A676 LS A679, LY A679, LG A679 - Hyper Micro SIDELED® LS Y876, LA Y876, LO Y876, LY Y876 LT Y87S - SmartLED LW L88C, LW L88S LB L89C, LB L89S, LG L890 LS L89K, LO L89K, LY L89K LS L896, LA L896, LO L896, LY L896 - TOPLED LS T670, LO T670, LY T670, LG T670, LP T670 LSG T670, LSP T670, LSY T670, LOP T670, LYG T670 LG T671, LOG T671, LSG T671 LB T673, LV T673, LT T673, LW T673 LH T674 LS T676, LA T676, LO T676, LY T676, LB T676, LH T676, LSB T676, LW T676 LB T67C, LV T67C, LT T67C, LS T67K, LO T67K, LY T67K, LW E67C LS E67B, LA E67B, LO E67B, LY E67B, LB E67C, LV E67C, LT E67C LW T67C LS T679, LY T679, LG T679 LS T770, LO T770, LY T770, LG T770, LP T770 LB T773, LV T773, LT T773, LW T773 LH T774 LS E675, LA E675, LY E675, LS T675 LS T776, LA T776, LO T776, LY T776, LB T776 LHGB T686 LT T68C, LB T68C - Hyper Mini TOPLED® LB M676 - Mini TOPLED Santana® LG M470 LS M47K, LO M47K, LY M47K Source: http://www.osram.convergy.de LUXEON: - LUMILED® LXK2-PW12-R00, LXK2-PW12-S00, LXK2-PW14-U00, LXK2-PW14-V00 LXK2-PM12-R00, LXK2-PM12-S00, LXK2-PM14-U00 LXK2-PE12-Q00, LXK2-PE12-R00, LXK2-PE12-S00, LXK2-PE14-T00, LXK2-PE14-U00 LXK2-PB12-K00, LXK2-PB12-L00, LXK2-PB12-M00, LXK2-PB14-N00, LXK2-PB14-P00, LXK2-PB14-Q00 LXK2-PR12-L00, LXK2-PR12-M00, LXK2-PR14-Q00, LXK2-PR14-R00 LXK2-PD12-Q00, LXK2-PD12-R00, LXK2-PD12-S00 LXK2-PH12-R00, LXK2-PH12-S00 LXK2-PL12-P00, LXK2-PL12-Q00, LXK2-PL12-R00 Source: www.luxeon.com KINGBRIGHT: KA-3528ASYC Source: www.kingbright.com
OPAMP1 OPAMP2 = motorFeedback:AD8616
POE = motorFeedback:CHB75W
Q1 = crystal:CRYSTAL: CRYSTAL; OC_FARNELL: unknown; OC_NEWARK: unknown
R1-R20 R23 R24 R32 R33 R36-R53 R57 R58 R61 R65 R66 R68 R99 R_LED = motorFeedback:R-US_: RESISTOR, American symbol
R21 R22 R25-R31 = rcl:R-US_: RESISTOR, American symbol
R34 R35 R55 R56 R59 R60 R62-R64 R67 = rcl_custom:R-US_: RESISTOR, American symbol
R54 = pot:TRIM_US-: POTENTIOMETER
REF1 = motorFeedback:ADR435
SW1 = motorFeedback:COM08720
TP1-TP7 = testpad:TP: Test pad
U1 = motorFeedback:STM32F407ZX
U3 = ksz8081:KSZ8081
VR2 = motorFeedback:LMZ14202H
VR3 = motorFeedback:TL751M08QKVURQ1: 8V power supply.
VR6 = motorFeedback:TLV1117-33I
VR8 = motorFeedback:TLE4275-Q
X4 = con-cypressindustries:MINI-USB-: MINI USB-B Conector Source: www.cypressindustries.com; OC_FARNELL: unknown; OC_NEWARK: unknown
X8 = motorFeedback:0826-1X1T-GJ-F

## Net classes
0 default: width 0.127 mm, drill 0.203 mm, clearance 0.127 mm
1 PWR: width 0.127 mm, drill 0.203 mm, clearance 0.127 mm to class 0, clearance 0.127 mm